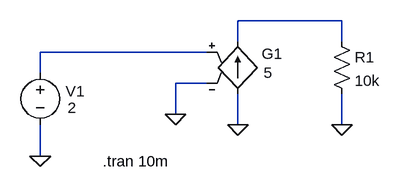
[diagram p0: schematic CurrentSource_VoltageDependent.asc]
CurrentSource_VoltageDependent.asc, the LTspice schematic file:
Version 4.1
SHEET 1 880 680
WIRE 384 112 224 112
WIRE 224 144 224 112
WIRE 384 144 384 112
WIRE 176 160 -80 160
WIRE -80 192 -80 160
WIRE 176 208 128 208
WIRE 128 256 128 208
WIRE 224 272 224 224
WIRE 384 272 384 224
WIRE -80 320 -80 272
FLAG 224 272 0
FLAG 384 272 0
FLAG -80 320 0
FLAG 128 256 0
SYMBOL g 224 128 R0
WINDOW 0 37 35 Left 2
WINDOW 3 40 64 Left 2
SYMATTR InstName G1
SYMATTR Value 5
SYMBOL res 368 128 R0
SYMATTR InstName R1
SYMATTR Value 10k
SYMBOL voltage -80 176 R0
WINDOW 123 0 0 Left 0
WINDOW 39 0 0 Left 0
WINDOW 0 39 44 Left 2
WINDOW 3 42 70 Left 2
SYMATTR InstName V1
SYMATTR Value 2
TEXT 16 328 Left 2 !.tran 10m

The netlist it stands for:
* CurrentSource_VoltageDependent.asc
G1 0 N001 N002 0 5
R1 N001 0 10k
V1 N002 0 2
.tran 10m
.backanno
.end

* Results of the author's LTspice run, read from the files saved beside the schematic
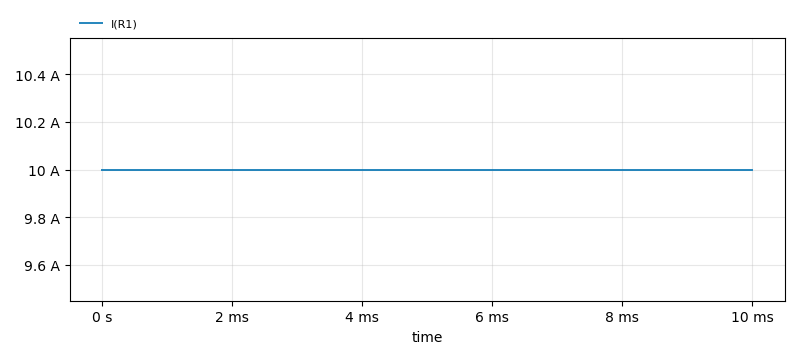
[diagram p1: Transient Analysis of CurrentSource_VoltageDependent.asc, plotted from the saved traces]
* Transient Analysis, 1 run:
*   I(R1): min 10 A, max 10 A, average 10 A, rms 10 A, last 10 A